# Altium schematic sheet [03] - AUDIO.SchDoc
size A3; DocumentNumber: 2; SheetNumber: 2; SheetTotal: 4
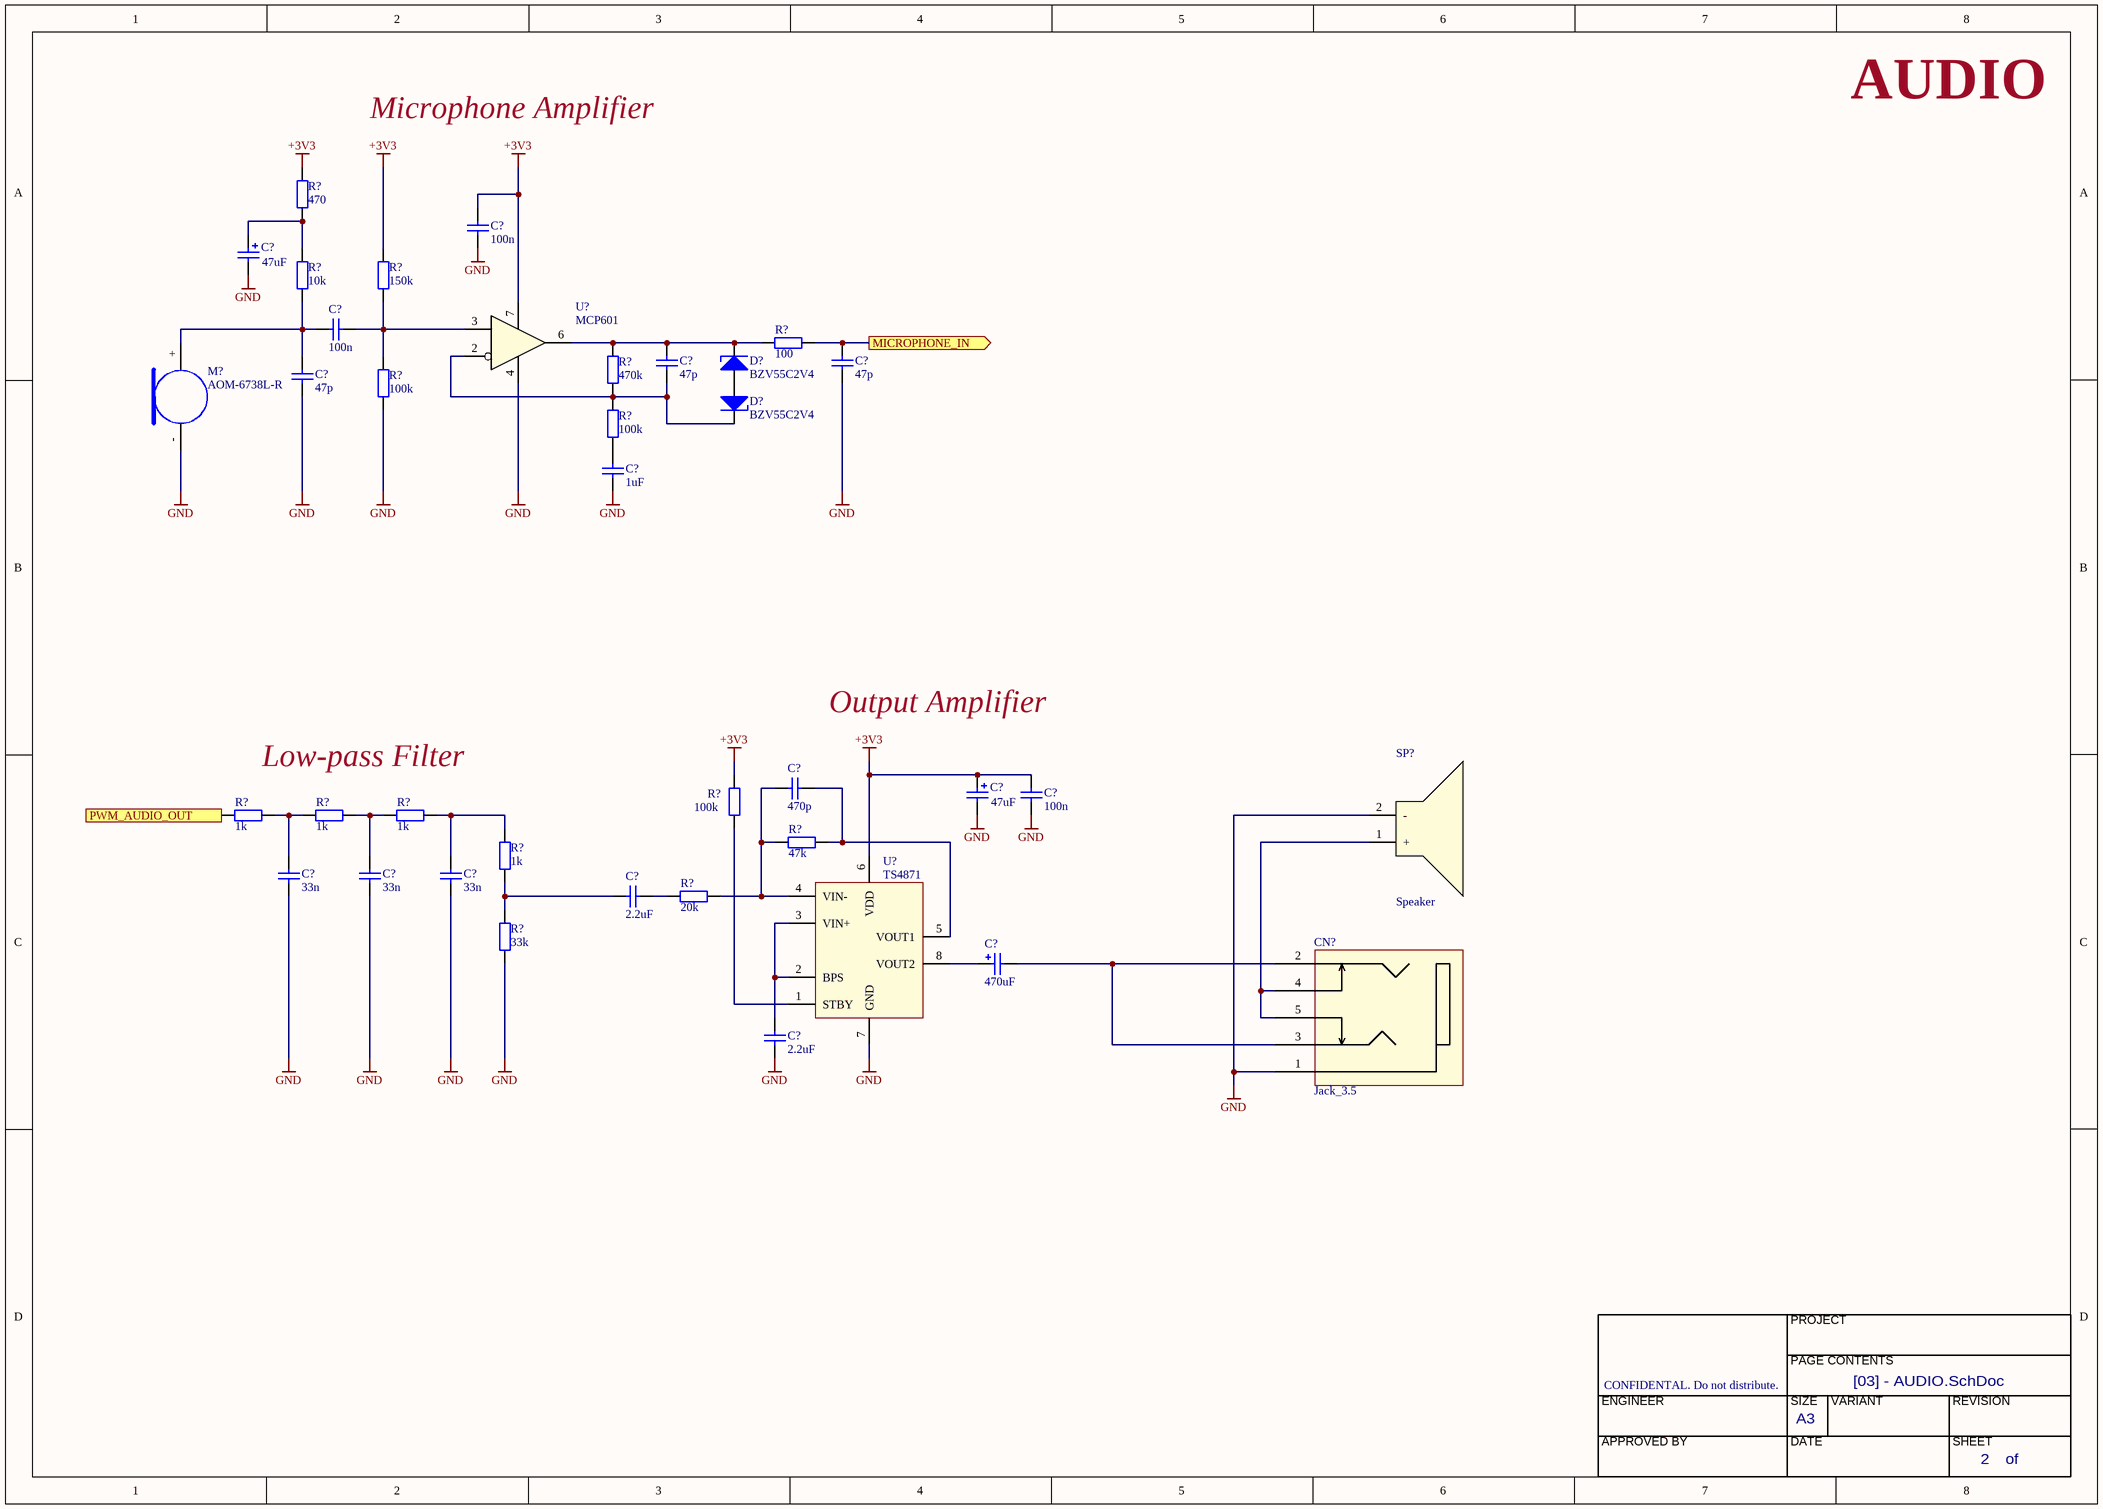
[diagram p0: [03] - AUDIO.SchDoc]

## Parts
(Parts that share a designator on the sheet are numbered #1, #2 ... from top to bottom, then left to right.)
C?#1  100n  [CAP0402]
C?#2  47uF  [CAPPR2-4x6.8]
C?#3  100n  [CAP0402]
C?#4  47p  [CAP0402]
C?#5  47p  [CAP0402]
C?#6  47p  [CAP0402]
C?#7  1uF  [CAP0402]
C?#8  470p  [CAP0402]
C?#9  47uF  [CAPPR2-4x6.8]
C?#10  100n  [CAP0402]
C?#11  33n  [CAP0402]
C?#12  33n  [CAP0402]
C?#13  33n  [CAP0402]
C?#14  2.2uF  [CAP0402]
C?#15  470uF  [CAPPR2-4x6.8]
C?#16  2.2uF  [CAP0402]
CN?  Jack_3.5
D?#1  BZV55C2V4  [SOD123]
D?#2  BZV55C2V4  [SOD123]
M?  AOM-6738L-R
R?#1  470  [RES0402]
R?#2  10k  [RES0402]
R?#3  150k  [RES0402]
R?#4  100  [RES0402]
R?#5  470k  [RES0402]
R?#6  100k  [RES0402]
R?#7  100k  [RES0402]
R?#8  100k  [RES0402]
R?#9  1k  [RES0402]
R?#10  1k  [RES0402]
R?#11  1k  [RES0402]
R?#12  1k  [RES0402]
R?#13  47k  [RES0402]
R?#14  20k  [RES0402]
R?#15  33k  [RES0402]
SP?  Speaker
U?#1  MCP601  [SOT23-5_PITCH0.95]
U?#2  TS4871

## Ports
MICROPHONE_IN (out), PWM_AUDIO_OUT (in)

## Nets
+3V3: C?#1.1 C?#9.1 C?#10.2 R?#1.2 R?#3.2 R?#8.1 U?#1.7(VCC+) U?#2.6(VDD)
GND: C?#1.2 C?#2.2 C?#5.2 C?#6.2 C?#7.2 C?#9.2 C?#10.1 C?#11.2 C?#12.2 C?#13.2 C?#16.1 CN?.1 M?.- R?#6.1 R?#15.2 SP?.2(-) U?#1.4(VCC-) U?#2.7(GND)
MICROPHONE_IN: C?#5.1 R?#4.1 ; port MICROPHONE_IN
PWM_AUDIO_OUT: R?#9.2 ; port PWM_AUDIO_OUT
NetC?#2_1: C?#2.1 R?#1.1 R?#2.2
NetC?#3_1: C?#3.1 C?#6.1 M?.+ R?#2.1
NetC?#3_2: C?#3.2 R?#3.1 R?#6.2 U?#1.3(IN+)
NetC?#4_1: C?#4.1 D?#1.C R?#4.2 R?#5.2 U?#1.6(OUT)
NetC?#4_2: C?#4.2 D?#2.C R?#5.1 R?#7.2 U?#1.2(IN-)
NetC?#7_1: C?#7.1 R?#7.1
NetC?#8_1: C?#8.1 R?#13.2 R?#14.1 U?#2.4(VIN-)
NetC?#8_2: C?#8.2 R?#13.1 U?#2.5(VOUT1)
NetC?#11_1: C?#11.1 R?#9.1 R?#10.2
NetC?#12_1: C?#12.1 R?#10.1 R?#11.2
NetC?#13_1: C?#13.1 R?#11.1 R?#12.1
NetC?#14_1: C?#14.1 R?#12.2 R?#15.1
NetC?#14_2: C?#14.2 R?#14.2
NetC?#15_1: C?#15.1 U?#2.8(VOUT2)
NetC?#15_2: C?#15.2 CN?.2 CN?.3
NetC?#16_2: C?#16.2 U?#2.2(BPS) U?#2.3(VIN+)
NetCN?_4: CN?.4 CN?.5 SP?.1(+)
NetD?#1_A: D?#1.A D?#2.A
NetR?#8_2: R?#8.2 U?#2.1(STBY)

## Notes on the sheet
- AUDIO
- Microphone Amplifier
- Output Amplifier
- (near R?#9) Low-pass Filter
- PROJECT
- CONFIDENTAL. Do not distribute.
- PAGE CONTENTS
- ENGINEER
- APPROVED BY
- SIZE
- DATE
- A3
- VARIANT
- REVISION
- SHEET
- of

## Library data of the parts
C?#1 C?#3-C?#8 C?#10-C?#14 C?#16 = Cap: Capacitor; Manufacturer: *; Manufacturer Part Number: *; Supplier 1: Digi-Key; Supplier Part Number 1: *
C?#2 C?#9 C?#15 = Cap Pol: Polarized Capacitor; Manufacturer: *; Manufacturer Part Number: *; Supplier 1: Digi-Key; Supplier Part Number 1: *; Supplier Price 1: *
D?#1 D?#2 = Diode_Zener: Zener Diode; pin to pad: A>1 C>2; Manufacturer: *; Manufacturer Part Number: *; Supplier 1: Digi-Key; Supplier Part Number 1: *
M? = Microphone
R?#1-R?#15 = Res: Resistor; Manufacturer: *; Manufacturer Part Number: *; Supplier 1: Digi-Key; Supplier Part Number 1: *
U?#1 = OPAMP x1